# EAGLE board CAMERA_SHIELD (EAGLE 9.5.2)
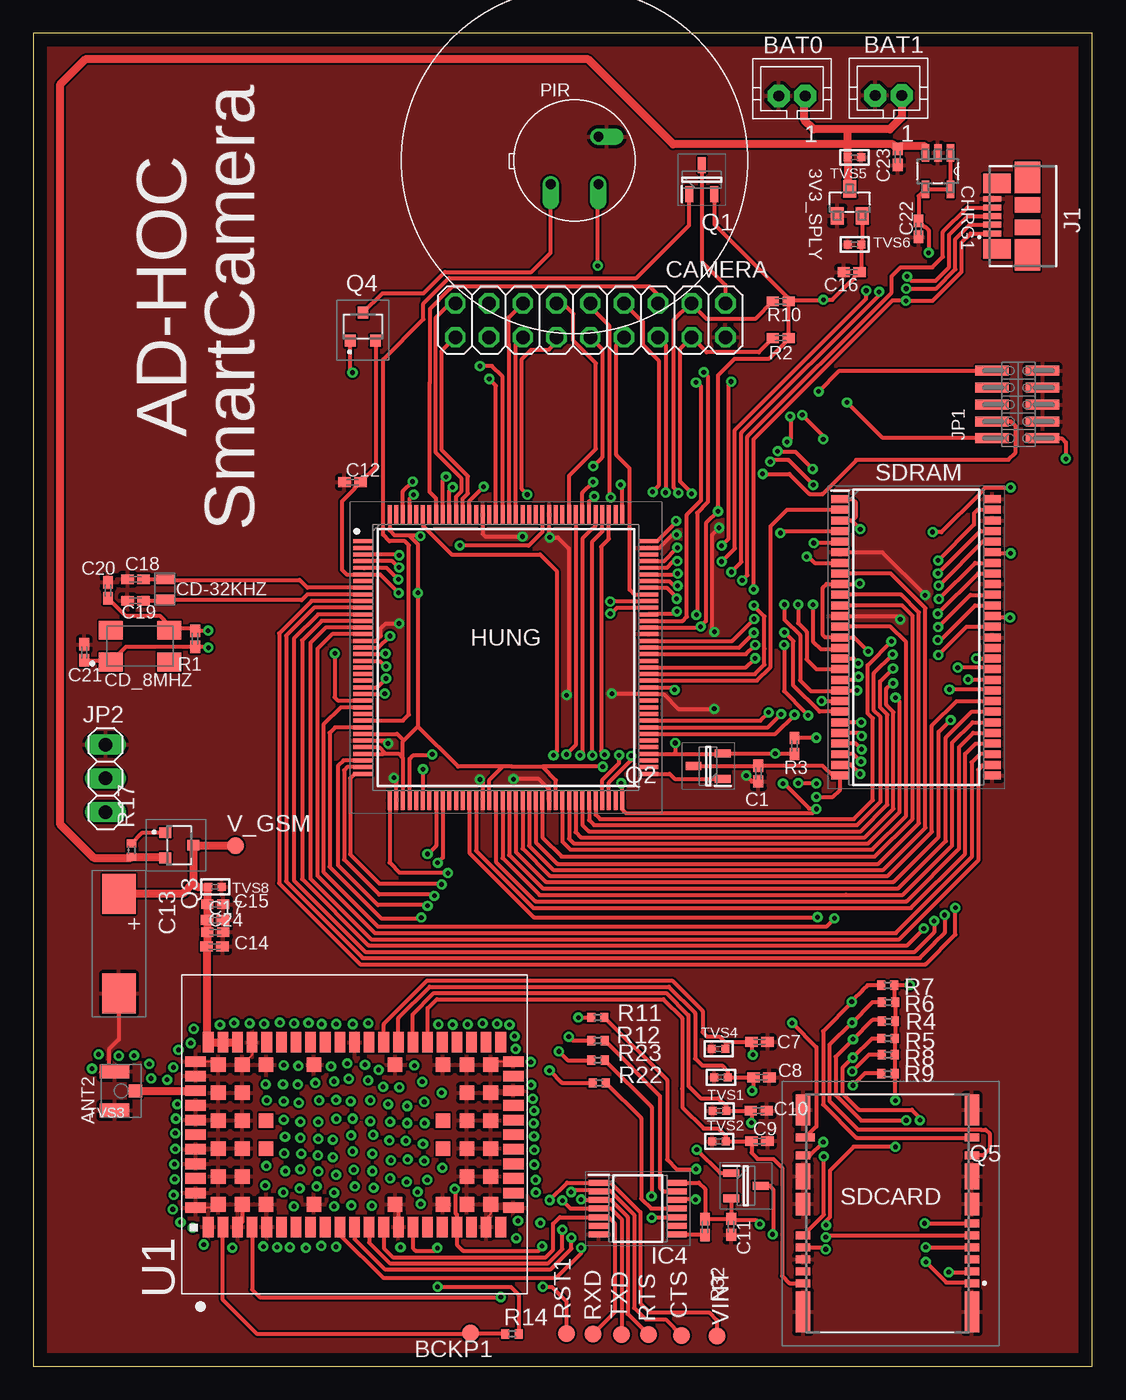
[diagram p3: board, top side]
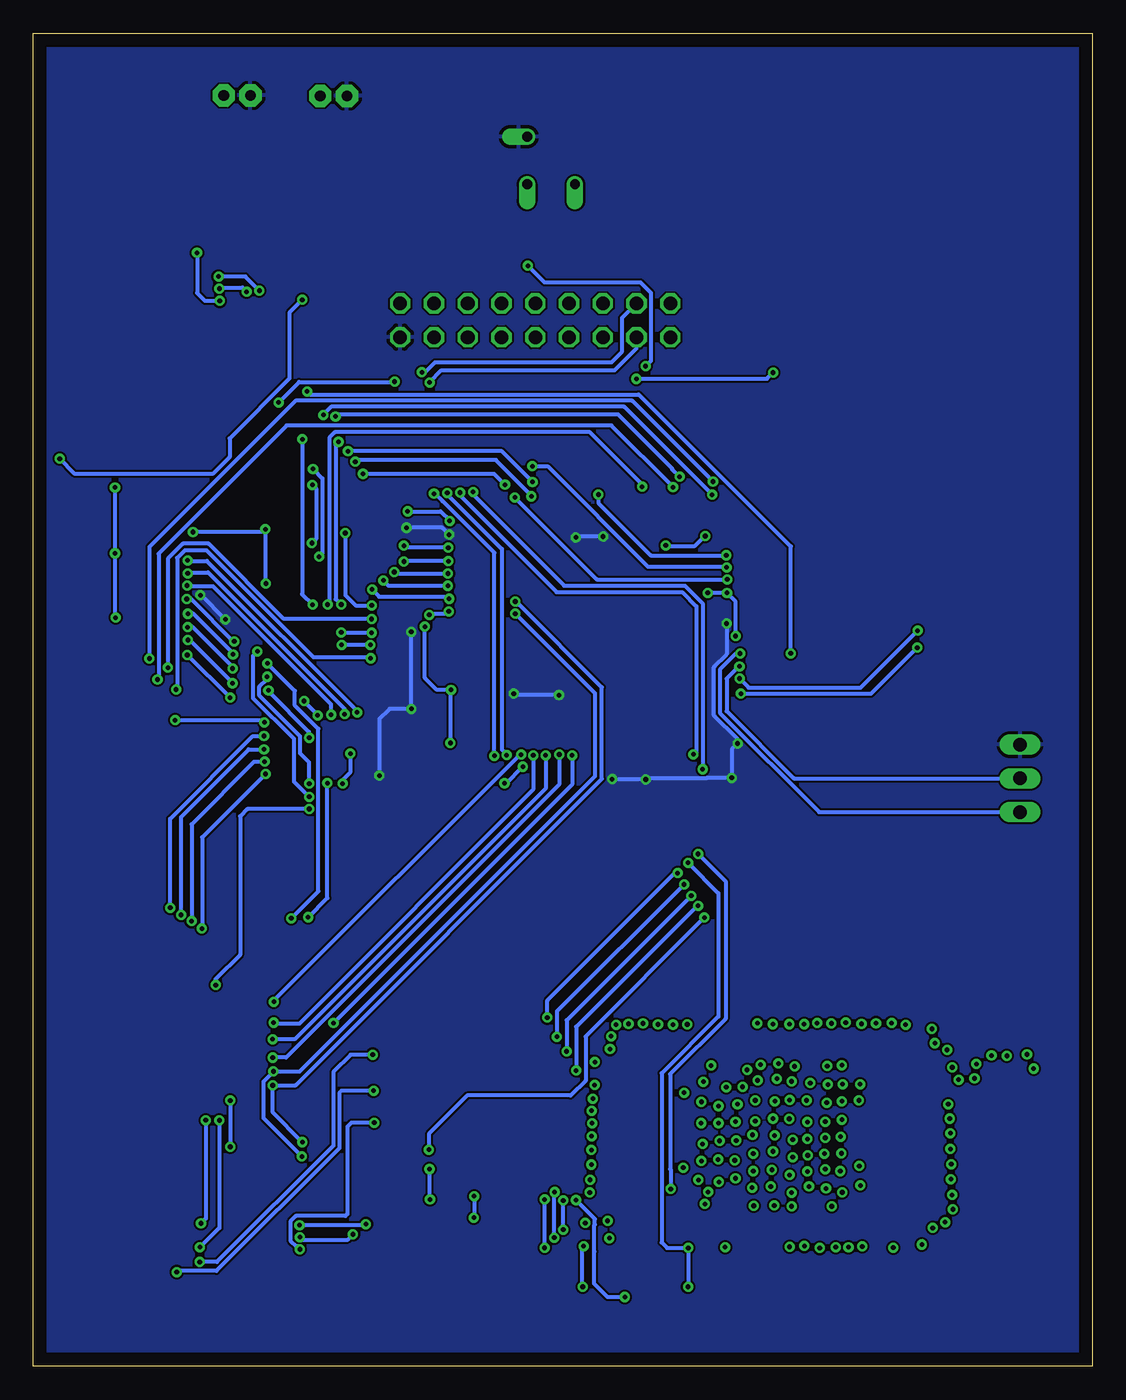
[diagram p4: board, bottom side, seen from below]

Size 79.68 x 100.32 mm. Coordinates in mm from the lower left corner, seen from the top.
Outline: 0,0 79.68,0 79.68,100.32 0,100.32 0,0
Copper layers (1*16): Top 0.035mm / dielectric 1.5mm / Bottom 0.035mm
Design rules "default": minimum track width 6mil, minimum drill 0.35mm, track to track 6mil, track to pad 6mil, pad to pad 6mil, via to via 6mil, smd to smd 6mil, copper to edge 40mil, drill to drill 6mil, minimum pad ring 10mil, minimum via ring 8mil, stop-mask expansion 4mil, vias tented up to drill 0mil, thermal gap 10mil

## Footprints (pad centres in the part's own frame; a part is rotated, then mirrored left to right if it is on the bottom)
SOT23 = smd 0.991 x 1.321: 1 -0.94,-1.016; 2 0.94,-1.016; 3 0,1.016
UFL_HIROSE = smd 1.05 x 2.2: GND@1 -1.475,0; GND@2 1.475,0 | smd 1 x 1: SIG 0,-1.575
JST-PH2 = drill 0.813 pad 1.676 octagon: 1 1,0; 2 -1,0
B1,27 = smd 1.27 x 1.27: TP 0,0
C0402K = smd 0.925 x 0.74: 1 -0.6,0; 2 0.6,0
7343_METRIC = smd 3 x 2.5: + -3.75,0; - 3.75,0
2X09 = drill 1.016 octagon: 1 -10.16,-1.27; 2 -10.16,1.27; 3 -7.62,-1.27; 4 -7.62,1.27; 5 -5.08,-1.27; 6 -5.08,1.27; 7 -2.54,-1.27; 8 -2.54,1.27; 9 0,-1.27; 10 0,1.27; 11 2.54,-1.27; 12 2.54,1.27; 13 5.08,-1.27; 14 5.08,1.27; 15 7.62,-1.27; 16 7.62,1.27; 17 10.16,-1.27; 18 10.16,1.27
2MM_X_1_2MM = smd 0.7 x 1.4: P$1 -0.75,0; P$2 0.75,0
CRYSTAL_ABRACON_6MM_3.6MM = smd 1.8 x 1.4: 1 -2.2,-1.2; 2 2.2,-1.2; 3 2.2,1.2; 4 -2.2,1.2
SOT23-5 = smd 1.321 x 0.559: 1 -1.372,0.94; 2 -1.372,0; 3 -1.372,-0.94; 4 1.372,-0.94; 5 1.372,0.94
QFP50P2200X2200X160-144N = smd 1.475 x 0.3: 1 -10.738,8.75; 2 -10.738,8.25; 3 -10.738,7.75; 4 -10.738,7.25; 5 -10.738,6.75; 6 -10.738,6.25; 7 -10.738,5.75; 8 -10.738,5.25; 9 -10.738,4.75; 10 -10.738,4.25; 11 -10.738,3.75; 12 -10.738,3.25; 13 -10.738,2.75; 14 -10.738,2.25; 15 -10.738,1.75; 16 -10.738,1.25; 17 -10.738,0.75; 18 -10.738,0.25; 19 -10.738,-0.25; 20 -10.738,-0.75; 21 -10.738,-1.25; 22 -10.738,-1.75; 23 -10.738,-2.25; 24 -10.738,-2.75; 25 -10.738,-3.25; 26 -10.738,-3.75; 27 -10.738,-4.25; 28 -10.738,-4.75; 29 -10.738,-5.25; 30 -10.738,-5.75; 31 -10.738,-6.25; 32 -10.738,-6.75; 33 -10.738,-7.25; 34 -10.738,-7.75; 35 -10.738,-8.25; 36 -10.738,-8.75; 73 10.738,-8.75; 74 10.738,-8.25; 75 10.738,-7.75; 76 10.738,-7.25; 77 10.738,-6.75; 78 10.738,-6.25; 79 10.738,-5.75; 80 10.738,-5.25; 81 10.738,-4.75; 82 10.738,-4.25; 83 10.738,-3.75; 84 10.738,-3.25; 85 10.738,-2.75; 86 10.738,-2.25; 87 10.738,-1.75; 88 10.738,-1.25; 89 10.738,-0.75; 90 10.738,-0.25; 91 10.738,0.25; 92 10.738,0.75; 93 10.738,1.25; 94 10.738,1.75; 95 10.738,2.25; 96 10.738,2.75; 97 10.738,3.25; 98 10.738,3.75; 99 10.738,4.25; 100 10.738,4.75; 101 10.738,5.25; 102 10.738,5.75; 103 10.738,6.25; 104 10.738,6.75; 105 10.738,7.25; 106 10.738,7.75; 107 10.738,8.25; 108 10.738,8.75 | smd 0.3 x 1.475: 37 -8.75,-10.738; 38 -8.25,-10.738; 39 -7.75,-10.738; 40 -7.25,-10.738; 41 -6.75,-10.738; 42 -6.25,-10.738; 43 -5.75,-10.738; 44 -5.25,-10.738; 45 -4.75,-10.738; 46 -4.25,-10.738; 47 -3.75,-10.738; 48 -3.25,-10.738; 49 -2.75,-10.738; 50 -2.25,-10.738; 51 -1.75,-10.738; 52 -1.25,-10.738; 53 -0.75,-10.738; 54 -0.25,-10.738; 55 0.25,-10.738; 56 0.75,-10.738; 57 1.25,-10.738; 58 1.75,-10.738; 59 2.25,-10.738; 60 2.75,-10.738; 61 3.25,-10.738; 62 3.75,-10.738; 63 4.25,-10.738; 64 4.75,-10.738; 65 5.25,-10.738; 66 5.75,-10.738; 67 6.25,-10.738; 68 6.75,-10.738; 69 7.25,-10.738; 70 7.75,-10.738; 71 8.25,-10.738; 72 8.75,-10.738; 109 8.75,10.738; 110 8.25,10.738; 111 7.75,10.738; 112 7.25,10.738; 113 6.75,10.738; 114 6.25,10.738; 115 5.75,10.738; 116 5.25,10.738; 117 4.75,10.738; 118 4.25,10.738; 119 3.75,10.738; 120 3.25,10.738; 121 2.75,10.738; 122 2.25,10.738; 123 1.75,10.738; 124 1.25,10.738; 125 0.75,10.738; 126 0.25,10.738; 127 -0.25,10.738; 128 -0.75,10.738; 129 -1.25,10.738; 130 -1.75,10.738; 131 -2.25,10.738; 132 -2.75,10.738; 133 -3.25,10.738; 134 -3.75,10.738; 135 -4.25,10.738; 136 -4.75,10.738; 137 -5.25,10.738; 138 -5.75,10.738; 139 -6.25,10.738; 140 -6.75,10.738; 141 -7.25,10.738; 142 -7.75,10.738; 143 -8.25,10.738; 144 -8.75,10.738
SOP65P640X120-14N = smd 1.475 x 0.45: 1 -2.938,1.95; 2 -2.938,1.3; 3 -2.938,0.65; 4 -2.938,0; 5 -2.938,-0.65; 6 -2.938,-1.3; 7 -2.938,-1.95; 8 2.938,-1.95; 9 2.938,-1.3; 10 2.938,-0.65; 11 2.938,0; 12 2.938,0.65; 13 2.938,1.3; 14 2.938,1.95
47346-0001 = smd 0.45 x 1.38: 1 1.3,-4.81; 2 0.65,-4.81; 3 0,-4.81; 4 -0.65,-4.81; 5 -1.3,-4.81 | smd 1.475 x 2.1: 6 -2.453,-4.45; 7 2.453,-4.45 | smd 1.175 x 1.9: 8 0.838,-2.15; 9 -0.838,-2.15 | smd 2.375 x 1.9: 10 2.913,-2.15; 11 -2.913,-2.15
PINHEAD_2X5_127 = smd 0.75 x 2.5: 1 -2.54,-1.81; 2 -2.54,2; 3 -1.27,-1.81; 4 -1.27,2; 5 0,-1.81; 6 0,2; 7 1.27,-1.81; 8 1.27,2; 9 2.54,-1.81; 10 2.54,2
1X03 = drill 1.016 long: 1 -2.54,0; 2 0,0; 3 2.54,0
SENBA_PIR = drill 0.75 offset: P$1 1.8,-1.8; P$2 -1.8,-1.8; P$3 1.8,1.8
SOT95P237X112-3N = smd 1.2 x 0.6: 1 -1.1,0.95; 2 -1.1,-0.95; 3 1.1,0
SSM3J332RLFT = smd 0.8 x 0.9: 1 -0.95,-1.05; 2 0.95,-1.05; 3 0,1.05
R0402 = smd 0.6 x 0.7: 1 -0.5,0; 2 0.5,0
1042391430 = smd 1.1 x 0.6: 1 6.35,3.7; 2 6.35,4.6; 3 -6.35,3.7; 4 6.35,5.5; 5 -6.35,4.6; 6 -6.35,6.4; 7 6.35,14.665; 8 6.35,13.31; 9 6.35,8.2; 10 6.35,7.3; 11 6.35,6.4; 12 -6.35,5.5; 13 -6.35,7.3; 14 -6.35,13.31 | smd 1.1 x 3.1: 15 -6.35,1.55; 22 6.35,1.55 | smd 1.1 x 1.72: 16 -6.35,9.66; 21 6.35,9.66 | smd 1.1 x 1.94: 17 -6.35,11.74; 20 6.35,11.74 | smd 1.1 x 2.3: 18 -6.35,16.75; 19 6.35,16.75 | smd 1.45 x 0.6: 23 -6.175,14.665
SOP80P1176X120-54N = smd 1.295 x 0.6: 1 -5.728,10.4; 2 -5.728,9.6; 3 -5.728,8.8; 4 -5.728,8; 5 -5.728,7.2; 6 -5.728,6.4; 7 -5.728,5.6; 8 -5.728,4.8; 9 -5.728,4; 10 -5.728,3.2; 11 -5.728,2.4; 12 -5.728,1.6; 13 -5.728,0.8; 14 -5.728,0; 15 -5.728,-0.8; 16 -5.728,-1.6; 17 -5.728,-2.4; 18 -5.728,-3.2; 19 -5.728,-4; 20 -5.728,-4.8; 21 -5.728,-5.6; 22 -5.728,-6.4; 23 -5.728,-7.2; 24 -5.728,-8; 25 -5.728,-8.8; 26 -5.728,-9.6; 27 -5.728,-10.4; 28 5.728,-10.4; 29 5.728,-9.6; 30 5.728,-8.8; 31 5.728,-8; 32 5.728,-7.2; 33 5.728,-6.4; 34 5.728,-5.6; 35 5.728,-4.8; 36 5.728,-4; 37 5.728,-3.2; 38 5.728,-2.4; 39 5.728,-1.6; 40 5.728,-0.8; 41 5.728,0; 42 5.728,0.8; 43 5.728,1.6; 44 5.728,2.4; 45 5.728,3.2; 46 5.728,4; 47 5.728,4.8; 48 5.728,5.6; 49 5.728,6.4; 50 5.728,7.2; 51 5.728,8; 52 5.728,8.8; 53 5.728,9.6; 54 5.728,10.4
TVS0402 = smd 0.6 x 0.6: 1 -0.508,0; 2 0.508,0
XCVR_LARA-R2 = smd 1.55 x 0.8: 1 -6.95,11; 2 -6.95,9.9; 3 -6.95,8.8; 4 -6.95,7.7; 5 -6.95,6.6; 6 -6.95,5.5; 7 -6.95,4.4; 8 -6.95,3.3; 9 -6.95,2.2; 10 -6.95,1.1; 11 -6.95,0; 12 -6.95,-1.1; 13 -6.95,-2.2; 14 -6.95,-3.3; 15 -6.95,-4.4; 16 -6.95,-5.5; 17 -6.95,-6.6; 18 -6.95,-7.7; 19 -6.95,-8.8; 20 -6.95,-9.9; 21 -6.95,-11; 33 6.95,-11; 34 6.95,-9.9; 35 6.95,-8.8; 36 6.95,-7.7; 37 6.95,-6.6; 38 6.95,-5.5; 39 6.95,-4.4; 40 6.95,-3.3; 41 6.95,-2.2; 42 6.95,-1.1; 43 6.95,0; 44 6.95,1.1; 45 6.95,2.2; 46 6.95,3.3; 47 6.95,4.4; 48 6.95,5.5; 49 6.95,6.6; 50 6.95,7.7; 51 6.95,8.8; 52 6.95,9.9; 53 6.95,11 | smd 0.8 x 1.55: 22 -5.5,-11.95; 23 -4.4,-11.95; 24 -3.3,-11.95; 25 -2.2,-11.95; 26 -1.1,-11.95; 27 0,-11.95; 28 1.1,-11.95; 29 2.2,-11.95; 30 3.3,-11.95; 31 4.4,-11.95; 32 5.5,-11.95; 54 5.5,11.95; 55 4.4,11.95; 56 3.3,11.95; 57 2.2,11.95; 58 1.1,11.95; 59 0,11.95; 60 -1.1,11.95; 61 -2.2,11.95; 62 -3.3,11.95; 63 -4.4,11.95; 64 -5.5,11.95 | smd 1.1 x 1.1: 65 -5.25,10.25; 66 -3.15,10.25; 67 -1.05,10.25; 68 1.05,10.25; 69 3.15,10.25; 70 5.25,10.25; 71 -5.25,8.45; 72 -3.15,8.45; 73 -1.05,8.45; 74 1.05,8.45; 75 3.15,8.45; 76 5.25,8.45; 77 -5.25,6.65; 78 5.25,6.65; 79 -5.25,3.05; 80 5.25,3.05; 81 -5.25,-3.05; 82 5.25,-3.05; 83 -5.25,-6.65; 84 5.25,-6.65; 85 -5.25,-8.45; 86 -3.15,-8.45; 87 -1.05,-8.45; 88 1.05,-8.45; 89 3.15,-8.45; 90 5.25,-8.45; 91 -5.25,-10.25; 92 -3.15,-10.25; 93 -1.05,-10.25; 94 1.05,-10.25; 95 3.15,-10.25; 96 5.25,-10.25; 97 -1.05,6.65; 98 1.05,6.65; 99 -1.05,-6.65; 100 1.05,-6.65

## Placement (x,y rotation side)
3V3_SPLY  MCP1700T-3302E/TT  [SOT23]  61.42,87.6 0 top
ANT2  U.FL-R-SMT-1  [UFL_HIROSE]  6.12,20.73 90 top
BAT0  [JST-PH2]  57.08,95.6 0 top
BAT1  [JST-PH2]  64.34,95.64 0 top
BCKP1  TPB1,27  [B1,27]  32.91,2.49 0 top
C1  0.1uF  [C0402K]  54.55,44.6 270 top
C7  47pF  [C0402K]  54.64,24.41 0 top
C8  47pF  [C0402K]  54.78,21.75 0 top
C9  47pF  [C0402K]  54.64,16.95 0 top
C10  47pF  [C0402K]  54.58,19.24 0 top
C11  0.1µF  [C0402K]  52.5,10.49 270 top
C12  0.1µF  [C0402K]  24.01,66.53 0 top
C13  KEMET_T520D337M006ATE045  [7343_METRIC]  6.45,31.81 270 top
C14  0.1µF  [C0402K]  13.64,31.59 0 top
C15  10nF  [C0402K]  13.69,34.77 0 top
C16  0.1µF  [C0402K]  61.57,82.34 180 top
C17  15pF  [C0402K]  13.68,33.58 0 top
C18  22pF  [C0402K]  7.7,59.23 0 top
C19  22pF  [C0402K]  7.69,57.61 0 top
C20  22pF  [C0402K]  5.62,58.4 270 top
C21  22pF  [C0402K]  3.84,53.73 270 top
C22  0.1µF  [C0402K]  66.6,85.59 90 top
C23  0.1µF  [C0402K]  65.03,91 90 top
C24  56pF  [C0402K]  13.69,32.67 0 top
CAMERA  0  [2X09]  41.91,78.71 180 top
CD-32KHZ  ABRACON_ABS06W-32_768KHZ-J-2-T  [2MM_X_1_2MM]  9.94,58.48 90 top
CD_8MHZ  ABMM2-8MHZ  [CRYSTAL_ABRACON_6MM_3.6MM]  8.03,54.2 0 top
CHRG1  MCP73811T-420I/OT  [SOT23-5]  68.05,89.94 270 top
CTS  TPB1,27  [B1,27]  48.78,2.31 0 top
HUNG  STM32F723ZET7  [QFP50P2200X2200X160-144N]  35.56,53.34 0 top
IC4  LSF0204PWR  [SOP65P640X120-14N]  45.48,11.87 0 top
J1  47346-0001  [47346-0001]  76.95,86.55 270 top
JP1  PINHEAD_5X2_127  [PINHEAD_2X5_127]  74.12,72.38 90 top
JP2  [1X03]  5.44,44.24 90 top
PIR  SENBA_PIR_3PIN  [SENBA_PIR]  40.72,90.74 0 top
Q1  FDN304P  [SOT95P237X112-3N]  50.3,89.3 90 top
Q2  FDN304P  [SOT95P237X112-3N]  50.77,45.16 180 top
Q3  SSM3J338R,LF  [SSM3J332RLFT]  10.99,39.21 270 top
Q4  SSM3J338R,LF  [SSM3J332RLFT]  24.8,78.23 0 top
Q5  FDN304P  [SOT95P237X112-3N]  53.62,13.59 0 top
R1  100k  [C0402K]  12.18,54.75 90 top
R2  4.7k  [C0402K]  56.23,77.37 0 top
R3  10k  [C0402K]  57.27,46.68 270 top
R4  100k  [R0402]  64.33,25.97 180 top
R5  100k  [R0402]  64.31,24.67 180 top
R6  100k  [R0402]  64.33,27.39 180 top
R7  100k  [R0402]  64.28,28.68 180 top
R8  100k  [R0402]  64.32,23.45 180 top
R9  100k  [R0402]  64.3,22.02 180 top
R10  4.7k  [C0402K]  56.23,80.14 0 top
R11  0  [R0402]  42.47,26.25 0 top
R12  0  [R0402]  42.48,24.51 0 top
R14  100k  [R0402]  36.02,2.43 0 top
R17  470k  [R0402]  7.4,38.84 90 top
R22  0  [R0402]  42.58,21.33 0 top
R23  0  [R0402]  42.48,23.04 0 top
R32  0  [C0402K]  50.54,10.48 270 top
RST1  TPB1,27  [B1,27]  40.1,2.48 0 top
RTS  TPB1,27  [B1,27]  46.27,2.4 0 top
RXD  TPB1,27  [B1,27]  42.12,2.44 0 top
SDCARD  104239-1430  [1042391430]  64.26,2.55 0 top
SDRAM  AS4C16M16SA-6TCN  [SOP80P1176X120-54N]  66.42,54.86 0 top
TVS1  TVS-0402  [TVS0402]  51.63,19.23 0 top
TVS2  TVS-0402  [TVS0402]  51.6,16.93 0 top
TVS3  TVS-0402  [TVS0402]  51.74,21.75 0 top
TVS4  TVS-0402  [TVS0402]  51.56,23.89 0 top
TVS5  TVS-0402  [TVS0402]  61.78,90.98 180 top
TVS6  TVS-0402  [TVS0402]  61.8,84.42 0 top
TVS8  TVS-0402  [TVS0402]  13.68,36.08 180 top
TXD  TPB1,27  [B1,27]  44.26,2.4 0 top
U1  LARA-R2  [XCVR_LARA-R2]  24.17,17.44 90 top
V_GSM  TPB1,27  [B1,27]  15.2,39.19 0 top
VINT  TPB1,27  [B1,27]  51.43,2.26 0 top

## Tracks (layer width: path | path; a pad name or v marks a point on that pad's centre or on a via)
3V3  (via drill 0.35)
  Top 0.305: 3V3_SPLY.2 62.36,84.47 TVS6.2 62.31,82.48 C16.1 61.74,81.91 61.74,81.84 61.56,81.67 61.52,81.67 60.11,80.26 v59.44,80.26 59.44,80.23 56.92,80.23 R10.2 | Q4.2 25.79,77.14 25.79,67.71 C12.2 24.18,66.1 24.18,66.03 23.21,65.07 23.21,59.95 23.57,59.59 HUNG.6 26.1,59.59 v27.49,58.2 | R10.2 56.77,80.2 56.77,80.42 51.25,85.94 Q1.2 | JP1.1 77.37,69.84 77.69,69.52 v77.69,68.3 | v65.95,28.69 v65.94,28.68 R7.1 64.78,27.45 R6.1 R4.1 64.83,24.69 R5.1 R8.1 64.82,22.04 R9.1 64.8,20.06 v64.86,20 | HUNG.76 48.22,46.09 | 48.22,46.09 51.85,46.09 Q2.2 v55.81,46.11 v55.82,46.1 57.25,46.1 R3.2 | v48.36,63.62 48.36,63.53 46.93,62.1 HUNG.108 | IC4.14 50.07,13.82 50.54,13.35 R32.1 C11.1 | v64.86,16.52 61.72,16.52 59.93,14.73 59.93,11.22 59.65,10.94 v59.65,10.62 | v54.65,10.7 54.38,10.97 52.62,10.97 C11.1 | HUNG.86 48.07,51.09 v48.25,50.91 | v48.3,46.91 48.3,46.17 48.22,46.09 | HUNG.17 25.97,54.09 v26.84,54.96 | HUNG.62 39.31,44.1 38.28,45.13 | 38.28,45.13 38.27,45.14 36.03,45.14 36.02,45.13 35.3,45.13 | 35.3,45.13 34.31,44.14 HUNG.52 | 35.3,45.13 31.95,45.13 28.93,48.16 | HUNG.144 26.81,62.92 27.18,62.55 28.24,62.55 | 28.24,62.55 28.93,61.86 v28.93,58.2 28.93,48.16 | 28.24,62.55 29.05,62.55 v29.12,62.48 | v32.1,61.78 32.12,61.76 37.27,61.76 38.32,62.81 38.32,64.07 HUNG.121 | Q5.2 52.52,11.11 C11.1 | 26.32,46.1 27.48,46.1 27.81,45.77 | 27.81,45.77 HUNG.39 | HUNG.33 26.31,46.09 26.32,46.1 | 26.32,46.1 26.41,46.19 26.01,46.59 HUNG.32 | v44.23,43.88 44.31,43.79 HUNG.72 44.31,41.92 44.59,41.64 58.62,41.64 v58.92,41.94 58.95,41.98 58.36,41.98 56.49,43.85 v56.41,43.85 | v42.84,45.12 v42.83,45.13 38.28,45.13
  Top 0.305: R10.2 R2.2 56.83,77.31 55.32,75.8 52.74,75.8 51.51,74.56 51.51,64.58 51.52,64.58 v51.52,64.34 51.49,64.34 50.6,63.45 50.6,56.07 50.21,55.68 v50.21,55.66 50.14,55.59 HUNG.95 | 27.81,45.77 27.81,47.03 27.88,47.09 | 27.88,47.09 28.93,48.16 | 27.88,47.09 27.38,47.59 HUNG.30
  Bottom 0.305: v65.95,28.69 65.95,29.14 64.12,30.97 64.12,41.39 63.57,41.94 v58.92,41.94 | v59.44,80.26 60.41,79.29 60.41,74.33 64.91,69.83 64.91,68.44 66.19,67.15 76.54,67.15 v77.69,68.3 | v56.41,43.85 56.41,44.12 55.84,44.69 55.84,46.08 v55.82,46.1 | v51.52,64.34 49.03,64.34 48.36,63.67 v48.36,63.62 | v64.86,20 v64.86,16.52 | v59.65,10.62 59.63,10.64 54.61,10.64 54.65,10.68 v54.65,10.7 | v48.3,46.91 48.3,50.86 v48.25,50.91 49.31,50.91 50.21,51.81 v50.21,55.66 | v26.84,54.96 26.84,57.55 v27.49,58.2 v28.93,58.2 | v29.12,62.48 29.16,62.48 29.9,61.74 32.06,61.74 v32.1,61.78 | v44.23,43.88 44.08,43.88 v42.84,45.12
3V3_CAMERA
  Top 0.305: Q1.3 50.3,83.14 52.07,81.37 CAMERA.1
3V3_SDCARD  (via drill 0.35)
  Top 0.305: v55.63,9.93 55.67,9.97 55.67,13.33 55.41,13.59 Q5.3 | v59.62,9.71 59.74,9.83 70.57,9.83 70.59,9.85 SDCARD.10
  Bottom 0.305: v55.63,9.93 56.07,9.49 59.4,9.49 v59.62,9.71
3V3_SDRAM  (via drill 0.35)
  Top 0.305: Q2.3 54.51,45.16 C1.1 59.37,45.2 60.17,44.41 60.67,44.41 60.69,44.38 | v62.81,53.8 61.75,54.86 SDRAM.14 59.57,54.86 59.4,55.03 59.4,58.6 59.68,58.88 60.67,58.88 SDRAM.9 62.14,58.86 v62.18,58.9 | v58.92,42.85 60.16,42.85 60.69,43.38 60.69,44.38 | 60.69,44.38 SDRAM.27 | SDRAM.1 61.63,65.26 61.86,65.03 61.86,63.91 61.61,63.66 | 61.61,63.66 SDRAM.3 | v62.21,62.99 61.61,63.59 61.61,63.66 | v73.53,66.14 73.51,66.12 71.63,66.12 71.2,65.69 71.2,65.66 68.31,62.77 v67.67,62.77 v67.66,62.78 | v73.53,61.18 72.23,61.18 SDRAM.49 | v73.48,56.34 72.27,56.34 SDRAM.43
  Bottom 0.305: v62.81,53.8 63.15,53.46 63.15,50.31 60.06,47.22 60.06,43.99 v58.92,42.85 | v62.18,58.9 62.18,62.96 v62.21,62.99 62.4,62.8 67.64,62.8 v67.66,62.78 | v73.53,66.14 v73.53,61.18 73.53,56.39 v73.48,56.34
ANT
  Top 0.61: ANT2.SIG U1.56
CARD_DET  (via drill 0.35)
  Top 0.305: v39.14,45.98 39.38,46.22 39.38,59.85 38.14,61.09 31.48,61.09 29.53,63.04 | v57.09,25.83 58.91,24.01 58.91,18.04 SDCARD.23 | HUNG.139 29.32,63.25 29.53,63.04 | 29.53,63.04
  Bottom 0.305: v57.09,25.83 39.14,43.78 v39.14,45.98
CTS  (via drill 0.35)
  Top 0.305: CTS.TP 47.57,3.52 46.08,3.52 45.21,4.39 45.21,11.4 43.42,13.19 42.56,13.19 IC4.2 42.48,13.24 40.61,13.24 40.48,13.11 v40.46,13.11 | U1.11 24.17,9.57 26.43,7.31 38.95,7.31 40.49,8.84 v40.49,9.68
  Bottom 0.305: v40.49,9.68 40.49,13.08 v40.46,13.11
DCMI_D0  (via drill 0.35)
  Top 0.305: v49.86,74.04 49.97,73.94 50.03,73.95 50.25,73.73 50.25,65.18 49.16,64.09 49.16,56.41 48.84,56.09 HUNG.96
  Bottom 0.305: CAMERA.16 34.29,76.6 35.94,74.96 48.98,74.96 49.86,74.08 v49.86,74.04
DCMI_D1  (via drill 0.35)
  Top 0.305: v50.44,74.81 50.78,74.47 50.78,65.06 49.94,64.22 49.94,56.6 v49.89,56.55 | v48.42,56.81 48.22,56.62 46.32,56.62 HUNG.97
  Bottom 0.305: v49.89,56.55 49.79,56.65 48.58,56.65 v48.42,56.81 | v50.44,74.81 50.2,74.81 49.45,75.56 36.17,75.56 35.37,76.36 35.37,78.91 CAMERA.15
DCMI_D2
  Top 0.305: CAMERA.14 36.3,76.92 36.3,64.11 36.31,64.11 HUNG.125
DCMI_D3
  Top 0.305: CAMERA.13 35.77,78.92 35.77,76.93 35.81,76.89 HUNG.126
DCMI_D4  (via drill 0.35)
  Top 0.305: v27.54,61.03 27.48,61.09 HUNG.3 | v37.16,65.6 36.76,66 36.76,75.8 37.46,76.5 38.8,76.5 39.37,77.07 CAMERA.12
  Bottom 0.305: v37.16,65.6 37.16,64.97 33.22,61.03 v27.54,61.03
DCMI_D5
  Top 0.305: HUNG.117 40.31,67.02 42.34,69.04 42.34,75.47 40.64,77.17 40.64,79.21 39.87,79.98 CAMERA.11
DCMI_D6  (via drill 0.35)
  Top 0.305: CAMERA.10 42.79,76.56 42.79,68.39 v42.13,67.73 | v27.52,60.12 27.48,60.12 27.02,60.59 25.35,60.59 HUNG.4
  Bottom 0.305: v42.13,67.73 40.98,67.73 33.44,60.18 27.58,60.18 v27.52,60.12
DCMI_D7  (via drill 0.35)
  Top 0.305: CAMERA.9 41.91,79.74 43.33,78.33 43.33,65.51 v43.45,65.39 | v27.47,59.21 27.24,59.44 26.59,60.09 24.99,60.09 24.98,60.09 HUNG.5
  Bottom 0.305: v43.45,65.39 37.27,59.21 v27.47,59.21
DCMI_HSYNC  (via drill 0.35)
  Top 0.305: CAMERA.6 47.57,76.86 v47.57,65.75 | v30.01,46.05 29.93,45.96 28.56,45.96 28.31,45.72 HUNG.40
  Bottom 0.305: v47.57,65.75 47.57,65.51 40.31,58.25 30.87,58.25 29.8,57.18 29.8,46.26 v30.01,46.05
DCMI_PIXCK  (via drill 0.35)
  Top 0.305: v46.59,65.8 v46.59,65.81 47.05,66.27 47.05,75.69 45.85,76.88 45.85,78.58 CAMERA.7 | v29.32,44.93 29.32,42.61 HUNG.42
  Bottom 0.305: v46.59,65.8 46.59,65.59 39.74,58.74 30.65,58.74 29.32,57.41 v29.32,44.93
DCMI_VSYNC
  Top 0.305: CAMERA.5 46.99,80.64 46.35,81.28 31.55,81.28 31.32,81.05 31.31,81.05 29.83,79.57 29.83,74 29.82,73.99 29.82,65.8 30.31,65.31 HUNG.137
FMC_A0  (via drill 0.35)
  Top 0.305: HUNG.10 20.94,57.59 18.5,55.15 18.5,36.34 24.59,30.25 67.14,30.25 69.37,32.48 v69.37,34.51 | v62.32,47.43 62.09,47.66 SDRAM.23
  Bottom 0.305: v69.37,34.51 69.37,41.21 63.15,47.43 v62.32,47.43
FMC_A1  (via drill 0.35)
  Top 0.305: HUNG.11 21.13,57.09 19.02,54.98 19.02,36.49 24.79,30.73 66.7,30.73 67.8,31.83 67.8,31.87 68.56,32.63 v68.56,33.97 | v62.32,46.43 61.89,46.86 SDRAM.24
  Bottom 0.305: v62.32,46.43 v62.33,46.42 63.47,46.42 68.56,41.33 v68.56,33.97
FMC_A2  (via drill 0.35)
  Top 0.305: HUNG.12 21.44,56.59 19.6,54.75 19.6,36.57 24.97,31.2 66.32,31.2 67.77,32.65 v67.77,33.5 | SDRAM.25 60.7,46.07 61.7,46.07 v62.27,45.5
  Bottom 0.305: v67.77,33.5 67.77,40.79 63.06,45.5 v62.27,45.5
FMC_A3  (via drill 0.35)
  Top 0.305: HUNG.13 21.7,56.09 20.23,54.62 20.23,36.67 25.22,31.68 65.76,31.68 67,32.92 v67,32.94 | v62.2,44.58 61.48,45.3 60.73,45.3 SDRAM.26
  Bottom 0.305: v62.2,44.58 66.97,39.81 66.97,32.97 v67,32.94
FMC_A4
  Top 0.305: HUNG.14 21.99,55.59 20.84,54.44 20.84,36.71 25.41,32.14 65.15,32.14 71.08,38.06 71.08,44.88 71.43,45.23 72.06,45.23 72.09,45.2 SDRAM.29
FMC_A5
  Top 0.305: HUNG.15 22.49,55.09 21.38,53.98 21.38,36.93 25.7,32.61 64.89,32.61 70.6,38.32 70.6,45.44 71.27,46.11 72.1,46.11 SDRAM.30
FMC_A6
  Top 0.305: HUNG.50 33.31,38.79 37.62,34.48 66.03,34.48 70.11,38.56 70.11,46.08 70.89,46.86 SDRAM.31
FMC_A7
  Top 0.305: HUNG.53 34.81,37.97 37.78,35 65.7,35 69.65,38.95 69.65,46.6 70.71,47.66 SDRAM.32
FMC_A8
  Top 0.305: HUNG.54 35.31,38.25 38.1,35.46 61.14,35.46 61.16,35.48 65.42,35.48 69.13,39.19 69.13,46.93 70.66,48.46 SDRAM.33
FMC_A9
  Top 0.305: HUNG.55 35.81,38.47 38.32,35.96 65.09,35.96 68.66,39.53 68.66,47.31 70.61,49.26 SDRAM.34
FMC_A10  (via drill 0.35)
  Top 0.305: HUNG.56 36.31,38.7 38.56,36.45 64.72,36.45 68.12,39.84 68.12,47.74 v69.01,48.62 | v62.29,48.46 SDRAM.22
  Bottom 0.305: v62.29,48.46 62.47,48.64 68.99,48.64 v69.01,48.62
FMC_A11
  Top 0.305: HUNG.57 36.81,38.97 38.87,36.91 64.3,36.91 67.61,40.22 67.61,48.21 69.46,50.06 SDRAM.35
FMC_A12  (via drill 0.35)
  Top 0.305: HUNG.89 53.61,52.59 v54.3,53.28 | SDRAM.36 72.08,50.93 v68.93,50.93
  Bottom 0.305: v54.3,53.28 54.39,53.37 58.6,53.37 66.64,61.41 68.28,61.41 68.85,60.83 68.85,51.03 68.93,50.95 v68.93,50.93
FMC_BA0  (via drill 0.35)
  Top 0.305: HUNG.91 53.62,53.59 v54.32,54.29 | v56.48,54.29 56.48,50.8 58.05,49.23 v58.29,48.99 | v59.31,50.07 SDRAM.20
  Bottom 0.305: v54.32,54.29 v56.48,54.29 | v58.29,48.99 58.29,49.02 59.31,50.04 v59.31,50.07
FMC_BA1  (via drill 0.35)
  Top 0.305: HUNG.92 53.11,54.09 v54.22,55.2 | SDRAM.21 59.15,49.26 57.19,51.22 57.19,54.58 56.54,55.23 v56.51,55.23
  Bottom 0.305: v56.51,55.23 54.25,55.23 v54.22,55.2
FMC_D0
  Top 0.305: HUNG.87 54.44,51.59 55.48,52.63 55.48,63.23 56.71,64.46 SDRAM.2
FMC_D1  (via drill 0.35)
  Top 0.305: HUNG.88 54.29,52.09 55,52.8 55,54 55,54.01 55,56.43 54.21,57.23 v54.21,57.26 | v56.2,62.7 56.2,62.86 SDRAM.4
  Bottom 0.305: v56.2,62.7 56.2,58.03 55.43,57.26 v54.22,57.26 v54.21,57.26
FMC_D2  (via drill 0.35)
  Top 0.305: v58.68,66.33 58.68,66.35 56.83,68.2 56.81,68.18 55.48,68.18 55.45,68.15 v55.45,68.07 | SDRAM.5 60.58,61.95 v58.72,61.95 | HUNG.114 41.81,65.08 v42.2,65.47
  Bottom 0.305: v58.68,66.33 58.41,66.06 58.41,62.26 v58.72,61.95 | v42.2,65.47 42.32,65.59 42.32,65.65 44.88,68.21 55.12,68.21 55.26,68.07 v55.45,68.07
FMC_D3  (via drill 0.35)
  Top 0.305: v58.63,67.53 58.47,67.69 58.46,67.69 57.33,68.83 56.04,68.83 v56,68.86 | v58.18,60.92 58.32,60.92 58.78,60.46 SDRAM.7 | HUNG.115 41.31,65.74 v42.12,66.55
  Bottom 0.305: v58.63,67.53 57.92,66.82 57.92,61.18 v58.18,60.92 | v42.12,66.55 44.43,68.86 v56,68.86
FMC_D4
  Top 0.305: HUNG.58 37.31,39.17 39.12,37.36 63.95,37.36 67.11,40.52 67.11,57.05 64.5,59.66 SDRAM.8
FMC_D5
  Top 0.305: HUNG.59 37.81,39.44 39.43,37.82 63.58,37.82 66.62,40.86 66.62,56.73 65.29,58.06 SDRAM.10
FMC_D6
  Top 0.305: HUNG.60 38.31,39.8 39.75,38.36 63.3,38.36 66.15,41.2 66.15,56.47 65.36,57.26 SDRAM.11
FMC_D7
  Top 0.305: HUNG.63 39.81,39.5 40.41,38.89 63.12,38.89 65.66,41.43 65.66,54.49 64.49,55.66 SDRAM.13
FMC_D8  (via drill 0.35)
  Top 0.305: HUNG.64 40.31,39.69 40.65,39.35 62.82,39.35 65.17,41.7 65.17,50.01 v64.87,50.32 | v68.1,53.53 70.23,55.66 SDRAM.42
  Bottom 0.305: v64.87,50.32 68.08,53.53 v68.1,53.53
FMC_D9  (via drill 0.35)
  Top 0.305: HUNG.65 40.81,40.2 41.2,39.81 62.57,39.81 64.72,41.95 64.72,49.23 64.18,49.77 64.18,51 64.53,51.35 64.64,51.35 v64.69,51.4 | v68.05,54.66 68.26,54.66 70.86,57.26 SDRAM.44
  Bottom 0.305: v64.69,51.4 64.67,51.41 67.92,54.66 v68.05,54.66
FMC_D10  (via drill 0.35)
  Top 0.305: HUNG.66 41.31,40.76 41.8,40.27 62.26,40.27 64.26,42.26 64.26,49.05 63.72,49.59 63.72,51.55 v64.68,52.51 | v68.07,55.62 70.5,58.05 72.14,58.05 SDRAM.45
  Bottom 0.305: v64.68,52.51 64.68,52.63 67.67,55.62 v68.07,55.62
FMC_D11  (via drill 0.35)
  Top 0.305: HUNG.67 41.81,41.11 42.2,40.72 61.98,40.72 63.74,42.49 63.74,48.85 63.24,49.34 63.24,52.16 v64.65,53.57 | v68.05,56.63 71.08,59.66 SDRAM.47
  Bottom 0.305: v64.65,53.57 64.65,53.65 67.63,56.63 v68.05,56.63
FMC_D12  (via drill 0.35)
  Top 0.305: HUNG.68 42.31,41.52 42.65,41.18 61.73,41.18 63.16,42.61 63.16,48.75 62.77,49.14 62.77,52.75 v64.56,54.54 v64.56,54.55 | v68.13,57.74 70.85,60.46 SDRAM.48
  Bottom 0.305: v64.56,54.55 64.62,54.55 67.81,57.74 v68.13,57.74
FMC_D13  (via drill 0.35)
  Top 0.305: HUNG.79 55.83,47.59 v57.27,49.03 | SDRAM.50 72.12,62.09 71.48,62.09 68.15,58.76 v68.11,58.76
  Bottom 0.305: v57.27,49.03 57.27,49.8 66.17,58.71 68.06,58.71 v68.11,58.76
FMC_D14  (via drill 0.35)
  Top 0.305: HUNG.80 55.27,48.09 v56.26,49.08 | v68.06,59.67 71.25,62.86 SDRAM.51
  Bottom 0.305: v56.26,49.08 56.26,49.48 66.52,59.74 67.99,59.74 v68.06,59.67
FMC_D15  (via drill 0.35)
  Top 0.305: HUNG.81 54.7,48.59 v55.32,49.21 | v68.07,60.64 70.76,63.33 70.76,64.18 71.04,64.46 SDRAM.53
  Bottom 0.305: v55.32,49.21 55.32,49.31 66.62,60.61 67.77,60.61 67.8,60.64 v68.07,60.64
FMC_SDCKE1  (via drill 0.35)
  Top 0.305: v70.33,51.68 72.13,51.68 SDRAM.37 | HUNG.135 31.31,65.91 v31.55,66.15
  Bottom 0.305: v70.33,51.68 70.33,51.76 70.25,51.84 70.25,61.16 60.62,70.79 36.19,70.79 v31.55,66.15
FMC_SDCLK  (via drill 0.35)
  Top 0.305: HUNG.93 52.58,54.59 v54.23,56.24 | SDRAM.38 72.04,52.57 v69.55,52.57
  Bottom 0.305: v69.55,52.57 69.55,60.77 68.43,61.9 66.48,61.9 60.82,56.24 v54.23,56.24
FMC_SDNCAS  (via drill 0.35)
  Top 0.305: v57.54,57.33 57.54,55.93 58.19,55.28 58.19,53.19 58.92,52.46 SDRAM.17 | HUNG.132 32.81,65.12 v33.88,66.19
  Bottom 0.305: v57.54,57.33 57.4,57.47 57.4,69.88 56.99,70.28 37.8,70.28 33.88,66.36 v33.88,66.19
FMC_SDNE1  (via drill 0.35)
  Top 0.305: v56.51,57.33 56.51,56.2 57.69,55.01 57.69,51.63 58.51,50.81 60.64,50.81 SDRAM.19 v61.97,50.86 v61.98,50.87 | HUNG.136 30.81,66.7 v31.05,66.94 | v56.71,69.57 56.99,69.85 56.99,71.42 v56.94,71.47 | v58.92,47.3 58.9,47.28 R3.1
  Bottom 0.305: v56.51,57.33 56.54,57.33 56.94,57.73 56.94,69.34 v56.71,69.57 | v31.05,66.94 31.61,67.5 31.61,67.55 35.7,71.64 56.77,71.64 v56.94,71.47 | v61.98,50.87 61.98,50.78 58.94,47.74 58.94,47.32 v58.92,47.3
FMC_SDNRAS  (via drill 0.35)
  Top 0.305: HUNG.49 32.81,38.64 37.66,33.8 v59,33.8 | v57.55,43.89 58.88,43.89 v58.92,43.85 | v62.08,51.89 61.85,51.66 SDRAM.18
  Bottom 0.305: v59,33.8 57.55,35.24 v57.55,43.89 | v58.92,43.85 58.92,45.44 59.6,46.13 59.6,47.41 62.66,50.47 62.66,51.15 62.08,51.73 v62.08,51.89
FMC_SDNWE  (via drill 0.35)
  Top 0.305: HUNG.26 23.14,49.59 21.83,48.28 21.83,37.21 25.96,33.08 59.64,33.08 v60.27,33.71 | v62.06,52.9 61.73,53.23 61.37,53.23 61.34,53.26 SDRAM.16
  Bottom 0.305: v60.27,33.71 58.24,35.74 58.24,47.97 59.99,49.73 59.99,50.83 v62.06,52.9
GND  (via drill 0.35)
  Top 0.152: U1.96 34.67,22.94 U1.32 | U1.91 34.42,11.49 34.07,11.14 U1.20 | U1.54 13.67,22.94 U1.70 | U1.50 16.47,23.44 U1.76 | U1.65 13.67,11.94 U1.64
  Top 0.305: U1.71 15.72,10.84 U1.3 | v51.23,49.48 48.54,49.48 47.43,50.59 HUNG.85 43.55,50.59 v43.53,50.62 | v53.64,44.45 54.09,44 C1.2 | U1.81 27.47,11.94 U1.14 | HUNG.61 38.8,42.62 38.8,43.43 38.05,44.18 v36.13,44.18 | v33.6,44.16 33.62,44.16 33.81,43.97 HUNG.51 | HUNG.38 27.31,44.11 v27.13,44.29 | HUNG.31 26.48,47.09 v26.7,46.87 | HUNG.130 33.81,62.64 34.02,62.43 36.79,62.43 v36.81,62.44 | HUNG.120 38.81,64.03 38.82,64.02 38.82,62.42 v38.86,62.38 39.46,62.38 40.3,61.54 40.3,50.68 v40.13,50.51 | SDRAM.12 64.98,56.46 v65.23,56.21 | v67.1,58.03 63.89,61.24 60.71,61.24 SDRAM.6 | v27.52,55.9 27.31,55.9 27.3,55.89 26.51,55.89 26.16,55.54 26.16,54.99 25.76,54.59 HUNG.16 | v48.4,62.58 48.11,62.58 47.11,61.58 HUNG.107 | v51.24,55.27 51.06,55.45 51.06,62.56 v51.6,63.1 | ANT2.GND@2 5.87,22.2 5.7,22.38 5.7,23.84 6.45,24.59 C13.-
  Bottom 0.305: v53.64,44.45 53.64,48.7 52.86,49.48 v51.23,49.48 v51.24,49.48 v51.24,55.27 | v36.13,44.18 33.71,44.18 | 33.71,44.18 33.69,44.16 v33.6,44.16 | 33.71,44.18 33.65,44.25 29.04,44.25 28.99,44.29 v27.13,44.29 27.13,46.44 v26.7,46.87 26.7,47.19 28.48,48.97 28.48,52.62 27.52,53.57 v27.52,55.9 | v36.81,62.44 38.8,62.44 v38.86,62.38 | v65.23,56.21 67.04,58.03 v67.1,58.03 | v48.4,62.58 48.92,63.1 v51.6,63.1 | v40.13,50.51 43.42,50.51 v43.53,50.62
  pour Top: 0.04,100.29 79.51,100.29 79.6,100.2 79.6,0.11 79.53,0.04 -0.09,0.04 -0.13,0 -0.13,100.2 -0.06,100.27 0.21,100.27 0.24,100.27
  pour Bottom: -0.1,100.26 79.43,100.26 79.56,100.13 79.56,0.16 79.53,0.13 0.02,0.13 0,0.15 0,100 0.19,100.19 0.25,100.25 0.69,100.25
GSM_EN
  Top 0.305: R17.2 8.22,40.16 Q3.1
GSM_PWR_ON  (via drill 0.35)
  Top 0.305: v30.4,8.9 30.2,8.7 28.75,8.7 28.57,8.88 U1.15 | R14.2 36.52,5.39 35.93,5.98 v30.42,5.98 | HUNG.45 30.81,38.28 v30.42,37.89
  Bottom 0.305: v30.42,5.98 30.4,6 v30.4,8.9 31.99,8.9 32.41,9.32 32.41,22.05 28.13,26.32 28.13,35.6 v30.42,37.89
GSM_RESET_N  (via drill 0.35)
  Top 0.305: v38.28,9.04 38.28,8.93 38.05,8.7 32.33,8.7 31.87,9.16 U1.18 31.87,11.41 31.77,11.51 31.77,13.29 v31.71,13.35 | v38.34,5.98 v38.35,5.97 39.02,5.97 40.1,4.89 RST1.TP | HUNG.44 30.31,39.16 29.68,38.53 v29.66,38.56
  Bottom 0.305: v38.28,9.04 38.4,8.92 38.4,6.04 v38.34,5.98 | v29.66,38.56 27.6,36.5 27.6,26.16 31.77,21.99 31.77,14.84 31.71,14.78 v31.71,13.35
I2C2_SCL  (via drill 0.35)
  Top 0.305: HUNG.69 42.81,44.12 44.08,45.4 44.08,45.68 44.06,45.7 v44.06,45.98 v44.07,45.99 | v48.53,65.72 48.53,65.79 48.16,66.16 48.16,78.73 49.41,79.98 CAMERA.3 49.53,79.95 50.66,78.82 54.31,78.82 R10.1
  Bottom 0.305: v44.07,45.99 44.07,46.05 44.42,46.4 44.42,61.5 48.53,65.61 v48.53,65.72
I2C2_SDA  (via drill 0.35)
  Top 0.305: HUNG.70 43.31,43.94 44.99,45.62 v44.99,45.95 | v49.53,65.67 49.53,65.73 48.67,66.59 48.67,76.58 CAMERA.4 50.66,76.32 54.58,76.32 R2.1
  Bottom 0.305: v44.99,45.95 44.99,61.23 48.86,65.1 48.88,65.1 49.5,65.72 49.5,65.7 v49.53,65.67
LDQM  (via drill 0.35)
  Top 0.305: v58.66,57.31 58.66,54.56 59.26,53.96 60.59,53.96 SDRAM.15 | HUNG.141 28.31,65.29 v28.61,65.59 | v59.43,69.76 59.43,70.01 v57.85,71.59
  Bottom 0.305: v58.66,57.31 59.46,58.11 59.43,58.14 v59.43,69.76 | v57.85,71.59 57.85,71.62 57.26,72.21 35.23,72.21 v28.61,65.59
MOSFET_CAMERA
  Top 0.305: HUNG.28 27.8,48.59 28.25,49.04 28.25,61.8 27.95,62.1 26.79,62.1 26.32,62.57 26.32,75.76 29.36,78.8 29.36,79.98 31.26,81.89 45.38,81.89 49.35,85.86 Q1.1
MOSFET_SDCARD  (via drill 0.35)
  Top 0.305: HUNG.29 22.71,48.09 22.29,47.67 22.29,37.59 26.17,33.71 29.13,33.71 v29.19,33.77 | v49.92,16.3 51.68,14.54 Q5.1
  Bottom 0.305: v29.19,33.77 38.13,24.82 38.13,21.49 39.24,20.38 47.03,20.38 49.92,17.49 v49.92,16.3
MOSFET_SDRAM
  Top 0.305: HUNG.73 47.87,44.59 48.26,44.2 Q2.1
N$3  (via drill 0.35)
  other vias: 10.54,22.5
N$4  (via drill 0.35)
  other vias: 10.93,23.81
N$5  (via drill 0.35)
  other vias: 11.85,24.32
N$6  (via drill 0.35)
  other vias: 12.07,25.39
N$8  (via drill 0.35)
  other vias: 14.05,25.7
N$9  (via drill 0.35)
  other vias: 15.11,25.83
N$10  (via drill 0.35)
  other vias: 4.42,22.4
N$11  (via drill 0.35)
  other vias: 16.28,25.82
N$12
  Top 0.305: IC4.8 50.5,9.92 R32.2
N$13  (via drill 0.35)
  other vias: 17.37,25.77
N$14  (via drill 0.35)
  other vias: 18.56,25.87
N$15  (via drill 0.35)
  other vias: 19.63,25.8
N$16  (via drill 0.35)
  other vias: 20.71,25.83
N$17  (via drill 0.35)
  other vias: 21.69,25.75
N$18  (via drill 0.35)
  other vias: 22.8,25.75
N$19  (via drill 0.35)
  other vias: 24.04,25.75
N$23  (via drill 0.35)
  other vias: 25.2,25.82
N$24  (via drill 0.35)
  other vias: 30.48,25.73
N$25  (via drill 0.35)
  other vias: 31.55,25.71
N$26  (via drill 0.35)
  other vias: 32.68,25.73
N$28  (via drill 0.35)
  other vias: 33.81,25.81
N$29  (via drill 0.35)
  other vias: 34.9,25.77
N$30  (via drill 0.35)
  other vias: 35.83,25.7
N$31  (via drill 0.35)
  other vias: 36.21,24.84
N$32  (via drill 0.35)
  other vias: 36.29,23.87
N$33  (via drill 0.35)
  other vias: 37.43,22.9
N$34  (via drill 0.35)
  other vias: 37.45,21.17
N$35  (via drill 0.35)
  other vias: 37.58,20.14
N$36  (via drill 0.35)
  other vias: 37.68,19.23
N$37  (via drill 0.35)
  other vias: 37.64,18.29
N$38  (via drill 0.35)
  other vias: 37.67,17.31
N$39  (via drill 0.35)
  other vias: 37.69,16.28
N$40  (via drill 0.35)
  other vias: 37.69,15.18
N$42  (via drill 0.35)
  other vias: 37.79,14.03
N$44  (via drill 0.35)
  other vias: 4.92,23.47
N$45  (via drill 0.35)
  other vias: 6.43,23.36
N$49  (via drill 0.35)
  other vias: 37.81,13.08
N$50  (via drill 0.35)
  other vias: 38.15,10.79
N$51  (via drill 0.35)
  other vias: 10.85,19.72
N$52  (via drill 0.35)
  other vias: 10.73,18.64
N$53  (via drill 0.35)
  other vias: 10.68,17.54
N$54  (via drill 0.35)
  other vias: 10.68,16.35
N$55  (via drill 0.35)
  other vias: 10.62,15.21
N$56  (via drill 0.35)
  other vias: 10.65,14.08
N$57  (via drill 0.35)
  other vias: 10.56,12.89
N$58  (via drill 0.35)
  other vias: 10.5,11.81
N$59  (via drill 0.35)
  other vias: 11.08,10.85
N$60  (via drill 0.35)
  other vias: 12.01,10.41
N$61  (via drill 0.35)
  other vias: 12.83,9.16
N$62  (via drill 0.35)
  other vias: 14.98,8.93
N$63  (via drill 0.35)
  other vias: 17.31,9.02
N$64  (via drill 0.35)
  other vias: 18.35,8.96
N$65  (via drill 0.35)
  other vias: 19.31,8.96
N$66  (via drill 0.35)
  other vias: 20.51,8.9
N$67  (via drill 0.35)
  other vias: 21.67,9.05
N$68  (via drill 0.35)
  other vias: 22.78,8.99
N$69  (via drill 0.35)
  other vias: 27.63,8.96
N$70  (via drill 0.35)
  other vias: 17.48,21.23
N$72  (via drill 0.35)
  other vias: 17.57,20.01
N$73  (via drill 0.35)
  other vias: 17.54,15.07
N$74  (via drill 0.35)
  other vias: 17.45,13.61
N$76  (via drill 0.35)
  other vias: 18.85,22.66
N$77  (via drill 0.35)
  other vias: 18.79,21.23
N$78  (via drill 0.35)
  other vias: 18.85,19.95
N$79  (via drill 0.35)
  other vias: 18.85,18.56
N$80  (via drill 0.35)
  other vias: 18.94,17.28
N$81  (via drill 0.35)
  other vias: 18.88,16.03
N$82  (via drill 0.35)
  other vias: 18.97,14.69
N$83  (via drill 0.35)
  other vias: 18.82,13.09
N$84  (via drill 0.35)
  other vias: 19.95,22.6
N$85  (via drill 0.35)
  other vias: 19.9,21.2
N$86  (via drill 0.35)
  other vias: 19.98,19.84
N$87  (via drill 0.35)
  other vias: 20.1,18.41
N$88  (via drill 0.35)
  other vias: 20.1,17.19
N$89  (via drill 0.35)
  other vias: 20.16,16
N$90  (via drill 0.35)
  other vias: 20.1,14.83
N$92  (via drill 0.35)
  other vias: 20.04,13.38
N$93  (via drill 0.35)
  other vias: 19.61,12.04
N$94  (via drill 0.35)
  other vias: 21.23,21.32
N$95  (via drill 0.35)
  other vias: 21.5,20.01
N$96  (via drill 0.35)
  other vias: 21.44,18.38
N$98  (via drill 0.35)
  other vias: 7.59,23.39
N$99  (via drill 0.35)
  other vias: 8.73,22.75
N$100  (via drill 0.35)
  other vias: 21.44,17.1
N$101  (via drill 0.35)
  other vias: 21.41,15.88
N$102  (via drill 0.35)
  other vias: 21.44,14.66
N$105  (via drill 0.35)
  other vias: 21.32,13.53
N$108  (via drill 0.35)
  other vias: 22.4,22.57
N$109  (via drill 0.35)
  other vias: 22.63,21.44
N$111  (via drill 0.35)
  other vias: 22.78,20.04
N$112  (via drill 0.35)
  other vias: 22.81,18.62
N$114  (via drill 0.35)
  other vias: 22.54,17.05
N$116  (via drill 0.35)
  other vias: 22.54,15.74
N$117  (via drill 0.35)
  other vias: 22.78,14.4
N$118  (via drill 0.35)
  other vias: 22.63,13.06
N$119  (via drill 0.35)
  other vias: 8.87,21.67
N$120  (via drill 0.35)
  other vias: 10.07,21.57
N$121  (via drill 0.35)
  other vias: 22.63,12.04
N$122  (via drill 0.35)
  other vias: 23.62,22.78
N$123  (via drill 0.35)
  other vias: 23.74,21.64
N$125  (via drill 0.35)
  other vias: 23.88,19.95
N$126  (via drill 0.35)
  other vias: 24.03,18.64
N$127  (via drill 0.35)
  other vias: 23.91,17.37
N$128  (via drill 0.35)
  other vias: 24.03,16.17
N$132  (via drill 0.35)
  other vias: 24.11,14.78
N$133  (via drill 0.35)
  other vias: 24.2,13.53
N$136  (via drill 0.35)
  other vias: 23.94,12.1
N$137  (via drill 0.35)
  other vias: 24.96,22.69
N$138  (via drill 0.35)
  other vias: 25.19,21.52
N$139  (via drill 0.35)
  other vias: 25.36,20.01
N$140  (via drill 0.35)
  other vias: 25.36,18.44
N$141  (via drill 0.35)
  other vias: 25.57,17.42
N$142  (via drill 0.35)
  other vias: 25.51,16
N$144  (via drill 0.35)
  other vias: 25.51,14.69
N$145  (via drill 0.35)
  other vias: 25.6,13.44
N$146  (via drill 0.35)
  other vias: 25.48,12.07
N$147  (via drill 0.35)
  other vias: 25.98,22.31
N$148  (via drill 0.35)
  other vias: 26.32,21.03
N$149  (via drill 0.35)
  other vias: 26.7,19.72
N$150  (via drill 0.35)
  other vias: 26.85,18.41
N$151  (via drill 0.35)
  other vias: 26.79,16.99
N$152  (via drill 0.35)
  other vias: 26.91,15.5
N$153  (via drill 0.35)
  other vias: 26.85,14.14
N$154  (via drill 0.35)
  other vias: 27.55,21
N$155  (via drill 0.35)
  other vias: 28.13,19.58
N$156  (via drill 0.35)
  other vias: 28.13,18.3
N$157  (via drill 0.35)
  other vias: 28.04,16.96
N$158  (via drill 0.35)
  other vias: 28.16,15.56
N$159  (via drill 0.35)
  other vias: 28.1,13.87
N$160  (via drill 0.35)
  other vias: 28.68,22.63
N$161  (via drill 0.35)
  other vias: 29.26,21.41
N$162  (via drill 0.35)
  other vias: 29.41,19.9
N$163  (via drill 0.35)
  other vias: 30.72,20.59
N$164  (via drill 0.35)
  other vias: 29.44,18.3
N$165  (via drill 0.35)
  other vias: 29.32,16.73
N$166  (via drill 0.35)
  other vias: 29.41,15.45
N$167  (via drill 0.35)
  other vias: 30.78,14.95
N$168  (via drill 0.35)
  other vias: 29.64,14.02
N$169  (via drill 0.35)
  other vias: 29.15,12.22
N$170  (via drill 0.35)
  other vias: 28.91,13.12
N$171  (via drill 0.35)
  other vias: 36.47,10.95
N$172  (via drill 0.35)
  other vias: 36.34,9.64
NRST  (via drill 0.35)
  Top 0.305: HUNG.25 24.8,50.07 22.95,50.07 22.68,50.34 22.68,53.6 22.69,53.61 v22.69,53.65 | v59.08,73.36 60.64,74.92 JP1.10
  Bottom 0.305: v22.69,53.65 22.69,61.7 34.13,73.14 58.86,73.14 v59.08,73.36
PIR_3V3
  Top 0.305: Q4.3 26.28,80.76 29.37,80.76 30.96,82.35 37.48,82.35 38.92,83.79 PIR.P$2
PIR_EN  (via drill 0.35)
  Top 0.305: v34.3,74.31 34.81,73.8 HUNG.128 | v24.02,74.78 23.85,74.95 Q4.1
  Bottom 0.305: v34.3,74.31 24.49,74.31 v24.02,74.78
PIR_INT  (via drill 0.35)
  Top 0.305: HUNG.127 35.31,74.47 34.51,75.27 v33.61,75.27 | v42.47,82.82 42.47,88.89 PIR.P$1
  Bottom 0.305: v33.61,75.27 33.2,75.68 33.2,80.77 33.99,81.56 41.2,81.56 v42.47,82.82
PWDN
  Top 0.305: HUNG.133 32.31,65.3 32.69,65.68 32.69,66.99 30.74,68.93 30.74,76.44 CAMERA.18
RCC_MCO_1
  Top 0.305: HUNG.100 45.21,58.09 44.86,58.44 44.86,66.05 44.87,66.06 44.87,67.57 43.86,68.58 43.86,76.85 CAMERA.8
RCC_OSC32_IN
  Top 0.305: HUNG.8 20.63,58.59 20.04,59.18 10.06,59.18 10.01,59.23 CD-32KHZ.P$2 C18.2
RCC_OSC32_OUT
  Top 0.305: HUNG.9 20.63,58.09 20.19,57.65 10.02,57.65 CD-32KHZ.P$1 9.82,57.61 C19.2
RCC_OSC_IN  (via drill 0.35)
  Top 0.305: 10.23,55.51 CD_8MHZ.3 | HUNG.23 25.87,51.09 v26.54,51.76 | 10.23,55.51 12.02,55.51 R1.2 v13.14,55.35 v13.15,55.36 | C20.2 6.94,56.48 9.5,56.48 10.23,55.75 10.23,55.51
  Bottom 0.305: v26.54,51.76 25.86,51.08 17.43,51.08 v13.15,55.36
RCC_OSC_OUT  (via drill 0.35)
  Top 0.305: HUNG.24 26.41,50.59 v26.44,50.62 | C21.2 5.7,53.13 CD_8MHZ.1 6.98,54.15 R1.1 12.35,54.15 13.11,54.15 v13.18,54.08
  Bottom 0.305: v26.44,50.62 16.64,50.62 v13.18,54.08
RESET
  Top 0.305: HUNG.134 31.81,65.44 32.23,65.87 32.23,66.8 30.29,68.74 30.29,78.93 31.34,79.98 CAMERA.17
RTS  (via drill 0.35)
  Top 0.305: RTS.TP 44.72,3.95 44.72,11.25 43.46,12.51 42.55,12.51 IC4.3 41.24,12.52 v41.21,12.55 | U1.10 23.07,9.91 26.32,6.66 39.35,6.66 41.21,8.52 v41.21,8.92
  Bottom 0.305: v41.21,8.92 v41.21,12.55
RXD
  Top 0.305: RXD.TP 43.73,4.05 43.73,10.78 43.3,11.21 42.55,11.21 IC4.5 39.61,11.22 39.12,10.73 39.12,8.77 38.57,8.22 27.03,8.22 26.37,8.88 U1.13
SDIO_CK  (via drill 0.35)
  Top 0.305: R4.2 63.74,26.06 63.12,26.06 v61.67,24.61 60.36,23.3 60.36,20.41 62.28,18.49 65.67,18.49 v65.68,18.5 | v67.14,8.96 SDCARD.11 | v41.14,45.98 41.35,46.19 41.35,62.33 42.06,63.04 42.09,63.04 42.31,63.26 42.31,64.06 42.31,64.07 HUNG.113
  Bottom 0.305: v41.14,45.98 41.14,43.48 60.01,24.61 v61.67,24.61 | v65.68,18.5 65.68,10.42 v67.14,8.96
SDIO_CMD  (via drill 0.35)
  Top 0.305: v40.11,46.04 40.81,46.74 HUNG.116 | SDCARD.9 70.58,10.76 v67.06,10.76 | R5.2 63.1,24.67 v61.66,23.23 60.87,22.44 60.87,20.55 62.11,19.31 66.09,19.31 66.7,18.7 v66.7,18.52
  Bottom 0.305: v40.11,46.04 40.11,43.78 60.66,23.23 v61.66,23.23 | v66.7,18.52 66.7,11.12 v67.06,10.76
SDIO_D0  (via drill 0.35)
  Top 0.305: R8.2 62.87,23.45 v61.61,22.19 | v43.41,56.64 43.64,56.87 43.7,56.87 43.92,57.09 HUNG.98 | SDCARD.13 59.47,11.41 v59.47,15.79
  Bottom 0.305: v43.41,56.64 37.41,50.64 37.41,44.42 59.64,22.19 v61.61,22.19 61.61,22.16 62.34,21.42 62.34,18.66 v59.47,15.79
SDIO_D1  (via drill 0.35)
  Top 0.305: v61.66,21.14 62.57,22.05 63.77,22.05 R9.2 | SDCARD.14 58.42,15.86 v59.43,16.87 | v43.41,57.55 43.45,57.59 HUNG.99
  Bottom 0.305: v43.41,57.55 43.19,57.32 43.13,57.32 36.89,51.09 36.89,44.2 59.94,21.15 61.65,21.15 v61.66,21.14 61.66,19.1 v59.43,16.87
SDIO_D2  (via drill 0.35)
  Top 0.305: SDCARD.7 70.59,17.2 61.93,17.2 59.42,19.71 59.42,25.22 61.58,27.38 v61.58,27.43 61.58,27.48 62.4,28.3 62.4,28.31 62.77,28.68 R7.2 | v42.98,46.03 42.73,46.28 42.73,61.68 43.31,62.26 HUNG.111
  Bottom 0.305: v61.58,27.43 61.58,27.52 43.02,46.08 43.02,46.07 v42.98,46.03
SDIO_D3  (via drill 0.35)
  Top 0.305: R6.2 63.13,27.39 v61.6,25.86 61.56,25.86 59.9,24.2 59.9,19.96 62.04,17.82 71.29,17.82 71.3,17.81 71.65,17.81 71.94,17.52 71.94,16.35 71.45,15.86 SDCARD.8 | v42.07,45.98 42.07,62.08 42.81,62.82 HUNG.112
  Bottom 0.305: v42.07,45.98 42.07,43.39 59.67,25.79 61.52,25.79 v61.6,25.86
SIM_CLK
  Top 0.305: U1.38 29.67,26.94 30.36,27.63 47.4,27.63 48.82,26.2 48.82,20.91 48.83,20.9 48.83,19.5 50.44,17.89 51.55,17.89 52.11,17.33 TVS2.2 54.02,16.93 C9.1 54.04,16.07 54.5,15.61 55.68,15.61 56.34,14.95 56.34,6.8 56.89,6.25 SDCARD.3
SIM_IO  (via drill 0.35)
  Top 0.305: U1.39 28.52,24.44 28.52,26.46 30.15,28.08 47.62,28.08 49.28,26.42 49.28,21.1 50.2,20.18 51.54,20.18 52.14,19.58 TVS1.2 C10.1 54.06,19.16 54.06,18.36 v54.03,18.33 | v59.62,8.8 59.51,8.91 57.95,8.91 SDCARD.6
  Bottom 0.305: v59.62,8.8 59.85,9.03 59.9,9.03 60.33,9.46 60.33,10.9 59.93,11.3 56.2,11.3 56.04,11.46 56.04,18.03 55.74,18.33 v54.03,18.33
SIM_RST  (via drill 0.35)
  Top 0.305: U1.40 27.47,26.21 29.82,28.57 47.81,28.57 49.8,26.58 49.8,23.16 50.33,22.63 51.82,22.63 52.25,22.2 TVS3.2 C8.1 54.18,20.84 v54.08,20.74 | v68.88,7.09 70.55,7.09 SDCARD.2
  Bottom 0.305: v54.08,20.74 56.48,20.74 56.65,20.57 56.65,16.41 65.9,7.17 68.8,7.17 v68.88,7.09
SWDCLK  (via drill 0.35)
  Top 0.305: HUNG.109 44.31,66.22 v44.19,66.34 | v54.87,67.16 56.88,67.16 58.4,65.65 59.33,65.65 59.37,65.61 61.91,68.15 61.91,68.23 73.36,68.23 73.9,68.77 73.9,70.75 73.55,71.1 JP1.4
  Bottom 0.305: v44.19,66.34 45.01,67.16 v54.87,67.16
SWDIO  (via drill 0.35)
  Top 0.305: HUNG.105 46.31,60.58 47.44,60.58 v48.46,61.6 | v51.79,61.75 52.32,62.28 52.32,73.93 52.49,74.1 v52.5,74.1 | v61.22,72.53 63.86,69.89 72.07,69.89 JP1.2
  Bottom 0.305: v48.46,61.6 51.64,61.6 v51.79,61.75 | v52.5,74.1 52.52,74.08 59.67,74.08 v61.22,72.53
TXD  (via drill 0.35)
  Top 0.305: TXD.TP 44.26,11.06 43.45,11.87 IC4.4 40.41,11.87 v39.8,12.48 | U1.12 25.27,9.31 26.82,7.76 38.76,7.76 39.8,8.81 v39.8,10.28
  Bottom 0.305: v39.8,10.28 v39.8,12.48
UART7_RX  (via drill 0.35)
  Top 0.305: HUNG.18 26.45,53.59 v26.5,53.64
  Bottom 0.305: v26.5,53.64 v26.51,53.63 26.82,53.63 28.02,52.43 28.02,49.16 20.56,41.7 JP2.1
UART7_TX  (via drill 0.35)
  Top 0.305: HUNG.19 24.71,53.09 24.7,53.08 26.09,53.08 26.49,52.67 v26.55,52.67
  Bottom 0.305: v26.55,52.67 26.78,52.44 26.82,52.44 27.51,51.76 27.51,49.3 22.45,44.24 JP2.2
UDQM  (via drill 0.35)
  Top 0.305: v70.94,53.26 70.97,53.23 72.12,53.23 SDRAM.39 | HUNG.142 27.81,65.85 v28.54,66.58
  Bottom 0.305: v70.94,53.26 70.94,61.67 59.95,72.67 34.62,72.67 v28.54,66.58
USART2_CTS  (via drill 0.35)
  Top 0.305: HUNG.34 23.35,45.59 22.92,45.16 22.92,37.71 25.92,34.71 29.61,34.71 v29.66,34.66 | v38.84,22.26 39.77,21.33 R22.1
  Bottom 0.305: v29.66,34.66 29.74,34.66 38.84,25.56 v38.84,22.26
USART2_CTS_P
  Top 0.305: R22.2 45.73,18.68 45.73,12.62 46.48,11.87 IC4.11
USART2_RTS  (via drill 0.35)
  Top 0.305: HUNG.35 23.62,45.09 23.38,44.85 23.38,38.14 26.02,35.5 30.09,35.5 v30.18,35.41 | v39.55,23.7 40.21,23.04 R23.1
  Bottom 0.305: v30.18,35.41 39.55,26.04 v39.55,23.7
USART2_RTS_P  (via drill 0.35)
  Top 0.305: R23.2 46.51,19.51 v46.51,12.8 | v46.53,11.19 46.56,11.22 IC4.10
  Bottom 0.305: v46.51,12.8 46.51,11.2 v46.53,11.19
USART2_RX  (via drill 0.35)
  Top 0.305: v31.2,37.12 31.18,37.14 27.58,37.14 26.81,37.91 HUNG.37 | v41.01,26.24 v41.02,26.25 R11.1
  Bottom 0.305: v41.01,26.24 41.01,27.53 31.42,37.12 v31.2,37.12
USART2_RX_P  (via drill 0.35)
  Top 0.305: IC4.12 48.47,12.47 48.55,12.55 v49.83,12.55 | R11.2 47.68,21.54 47.68,15.56 48.4,14.84 v49.87,14.84
  Bottom 0.305: v49.87,14.84 49.87,12.59 v49.83,12.55
USART2_TX  (via drill 0.35)
  Top 0.305: HUNG.36 24.19,44.59 23.84,44.24 23.84,38.53 26.06,36.3 30.68,36.3 v30.72,36.26 | v40.29,24.8 40.56,24.53 41.96,24.53 R12.1
  Bottom 0.305: v30.72,36.26 40.29,26.69 v40.29,24.8
USART2_TX_P
  Top 0.305: R12.2 47.14,20.35 47.14,13.43 47.4,13.17 IC4.13
USB_OTG_FS_DM  (via drill 0.35)
  Top 0.305: v52.52,59.77 53.28,60.53 53.28,70.25 63.63,80.61 v63.63,80.87 | v65.67,81.1 67.93,81.1 69.38,82.55 69.38,84.84 70.44,85.9 J1.2 | HUNG.103 48.42,59.59 v48.48,59.65
  Bottom 0.305: v52.52,59.77 52.4,59.65 v48.48,59.65 | v63.63,80.87 63.94,81.18 65.6,81.18 v65.67,81.1
USB_OTG_FS_DP  (via drill 0.35)
  Top 0.305: HUNG.104 47.65,60.09 48.14,60.58 v48.45,60.58 | v51.79,60.56 52.78,61.55 52.78,70.45 62.66,80.34 v62.66,80.95 | v65.74,82.01 66.08,81.68 67.86,81.68 68.9,82.72 68.9,85.16 70.29,86.55 J1.3
  Bottom 0.305: v48.45,60.58 51.77,60.58 v51.79,60.56 | v62.66,80.95 63.73,82.01 v65.74,82.01
USB_OTG_FS_ID  (via drill 0.35)
  Top 0.305: HUNG.102 47.85,59.09 48.21,58.74 v48.48,58.74 | v53.34,59.14 53.73,59.53 53.73,69.96 64.58,80.8 64.58,82.03 65.26,82.71 67.65,82.71 68.44,83.5 68.44,85.37 70.27,87.2 J1.4
  Bottom 0.305: v48.48,58.74 52.94,58.74 v53.34,59.14
USB_OTG_FS_VBUS  (via drill 0.35)
  Top 0.305: HUNG.101 47.65,58.59 48.44,57.8 v48.4,57.76 | v54.19,58.46 54.19,69.77 64.63,80.21 65.62,80.21 v65.65,80.18 67.66,80.18 69.84,82.36 69.84,84.58 70.51,85.25 J1.1 | v67.36,83.79 67.36,85.49 67.1,85.76 67.03,85.76 C22.2 66.6,88.06 CHRG1.4 68.91,88.57 | 68.91,88.57 CHRG1.5 | CHRG1.1 68.99,88.65 68.91,88.57
  Bottom 0.305: v48.4,57.76 48.56,57.93 53.66,57.93 v54.19,58.46 | v67.36,83.79 67.36,80.77 66.77,80.18 v65.65,80.18
V_BCKP_SIG
  Top 0.305: R14.1 35.46,2.49 BCKP1.TP 32.88,2.46 16.81,2.46 14.27,5 U1.2
V_GSM
  Top 0.61: 12.04,36.37 Q3.3 15.18,39.21 V_GSM.TP | 12.04,36.37 12.33,36.08 TVS8.2 13.09,36 C15.1 C17.1 C24.1 13.09,31.64 C14.1 13.04,24.52 U1.53 U1.52 U1.51 | 12.04,36.37 11.23,35.56 C13.+
V_INT  (via drill 0.35)
  Top 0.305: U1.4 16.47,5.77 17.03,5.21 v35.17,5.21 | v38.85,12.51 40.16,13.82 IC4.1 43.44,13.82 45.67,11.59 45.67,4.75 46.37,4.05 50.85,4.05 51.43,3.47 VINT.TP
  Bottom 0.305: v35.17,5.21 36.47,5.21 37.48,6.22 37.48,8.6 37.46,8.62 37.46,10.64 37.43,10.67 37.43,11.09 v38.85,12.51
VBAT
  Top 0.61: BAT1.1 65.34,93.99 64.44,93.09 61.19,93.09 | BAT0.1 58.02,95.54 58.02,93.78 58.71,93.09 61.19,93.09 | 61.27,91.96 61.27,93.01 61.19,93.09 | 61.27,91.96 64.67,91.96 C23.2 65.28,91.85 67,91.85 67.11,91.74 CHRG1.3 | 3V3_SPLY.3 61.27,88.76 TVS5.2 61.27,91.96 | 61.27,91.96 48.14,91.96 41.75,98.35 3.92,98.35 2,96.43 2,40.83 4.57,38.26 7.32,38.26 R17.1 9.86,38.34 Q3.2
VSIM  (via drill 0.35)
  Top 0.305: U1.41 26.37,25.76 29.63,29.02 48.06,29.02 50.35,26.73 50.35,25.13 50.67,24.81 51.6,24.81 52.12,24.29 | TVS4.2 52.12,23.89 52.12,24.29 | 52.12,24.29 52.12,24.41 C7.1 54.04,23.55 v54.14,23.45 | v67.15,7.85 68.68,6.32 70.54,6.32 SDCARD.1
  Bottom 0.305: v67.15,7.85 65.86,7.85 57.11,16.6 57.11,22.14 55.8,23.45 v54.14,23.45

## Text on the board
tPlace: AD-HOC | SmartCamera